# EAGLE design main (EAGLE 6.6.0)
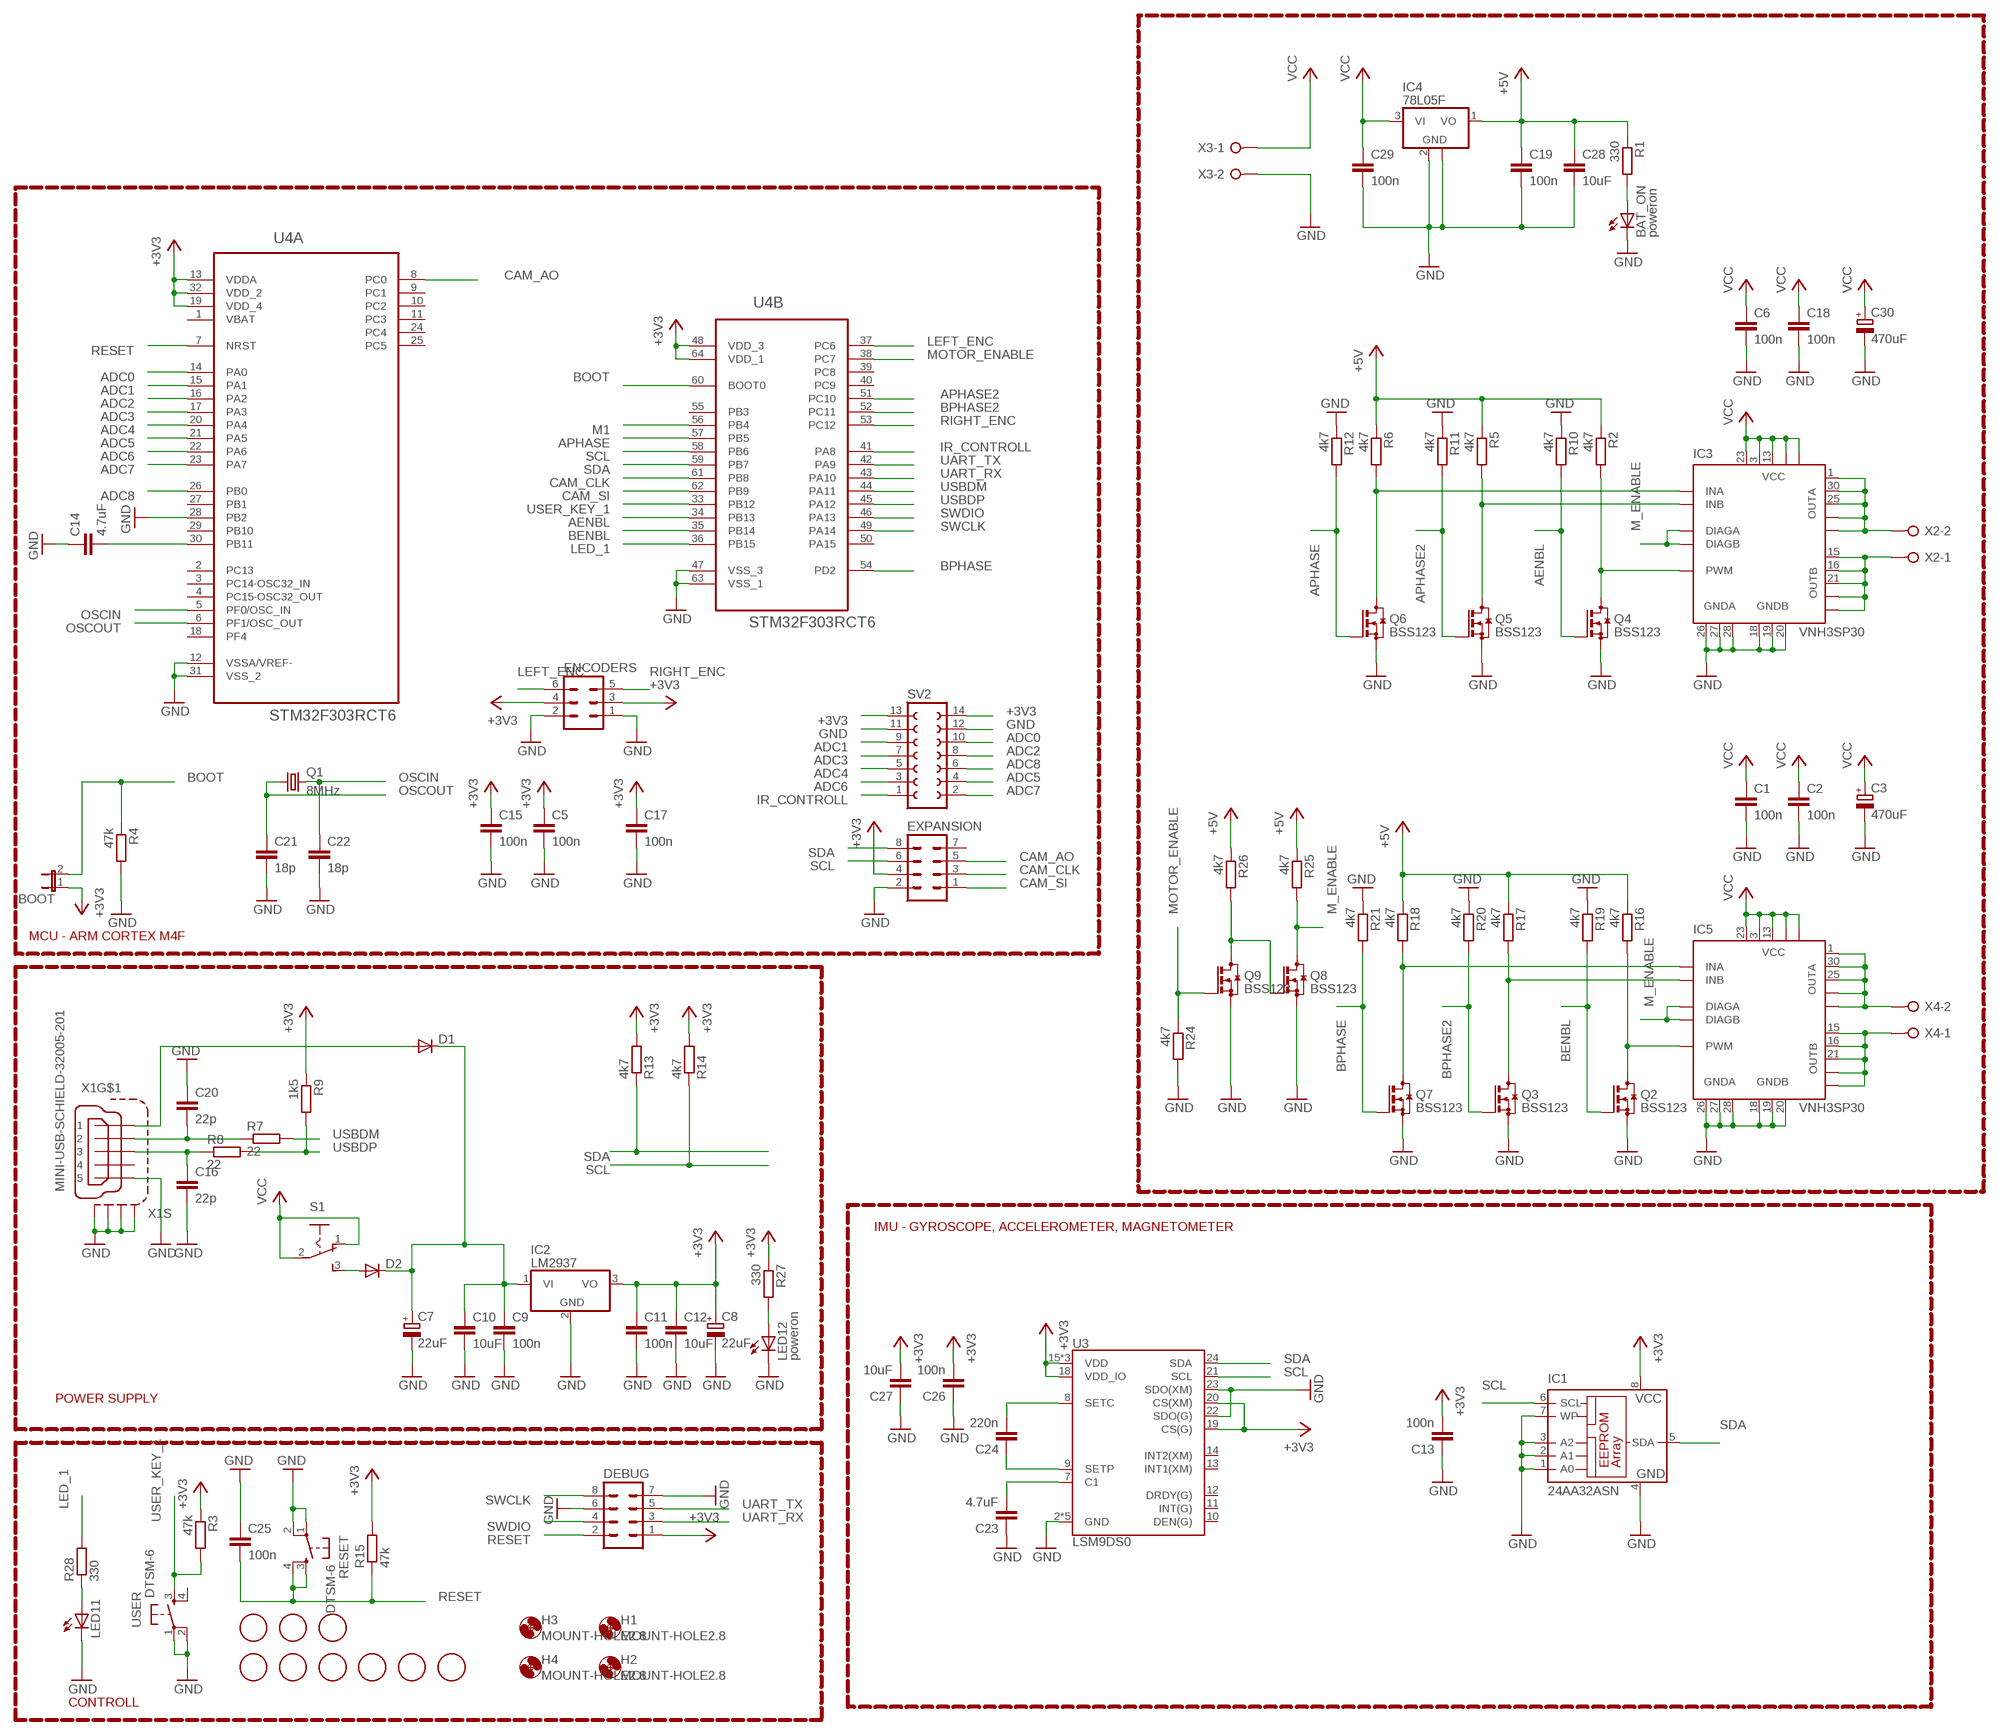
[diagram p0: schematic, sheet 1]

## Parts
BAT_ON  poweron  LEDCHIPLED_1206  [CHIPLED_1206]
BOOT  JP1E  [JP1]
C1  100n  C-EUC0805  [C0805]
C2  100n  C-EUC0805  [C0805]
C3  470uF  CPOL-EU140CLH-1014  [140CLH-1014]
C5  100n  C-EUC0805  [C0805]
C6  100n  C-EUC0805  [C0805]
C7  22uF  CPOL-EU153CLV-0505  [153CLV-0505]
C8  22uF  CPOL-EU153CLV-0505  [153CLV-0505]
C9  100n  C-EUC0805  [C0805]
C10  10uF  C-EUC0805  [C0805]
C11  100n  C-EUC0805  [C0805]
C12  10uF  C-EUC0805  [C0805]
C13  100n  C-EUC0805  [C0805]
C14  4.7uF  C-EUC0805  [C0805]
C15  100n  C-EUC0805  [C0805]
C16  22p  C-EUC0805  [C0805]
C17  100n  C-EUC0805  [C0805]
C18  100n  C-EUC0805  [C0805]
C19  100n  C-EUC0805  [C0805]
C20  22p  C-EUC0805  [C0805]
C21  18p  C-EUC0805  [C0805]
C22  18p  C-EUC0805  [C0805]
C23  4.7uF  C-EUC0805  [C0805]
C24  220n  C-EUC0805  [C0805]
C25  100n  C-EUC0805  [C0805]
C26  100n  C-EUC0805  [C0805]
C27  10uF  C-EUC0805  [C0805]
C28  10uF  C-EUC0805  [C0805]
C29  100n  C-EUC0805  [C0805]
C30  470uF  CPOL-EU140CLH-1014  [140CLH-1014]
D1  DIODE-SMB  [SMB]
D2  DIODE-SMB  [SMB]
DEBUG  MA04-2  [MA04-2]
ENCODERS  MA03-2  [MA03-2]
EXPANSION  MA04-2  [MA04-2]
H1  MOUNT-HOLE2.8  [2,8]
H2  MOUNT-HOLE2.8  [2,8]
H3  MOUNT-HOLE2.8  [2,8]
H4  MOUNT-HOLE2.8  [2,8]
IC1  24AA32ASN  [SO-08]
IC2  LM2937  [TO263-3]
IC3  VNH3SP30  [MULTIPOWERSO-30]
IC4  78L05F  [SOT89]
IC5  VNH3SP30  [MULTIPOWERSO-30]
LED11  LEDCHIPLED_1206  [CHIPLED_1206]
LED12  poweron  LEDCHIPLED_1206  [CHIPLED_1206]
Q1  8MHz  CRYSTALCTS406  [CTS406]
Q2  BSS123  [SOT23]
Q3  BSS123  [SOT23]
Q4  BSS123  [SOT23]
Q5  BSS123  [SOT23]
Q6  BSS123  [SOT23]
Q7  BSS123  [SOT23]
Q8  BSS123  [SOT23]
Q9  BSS123  [SOT23]
R1  330  R-EU_M0805  [M0805]
R2  4k7  R-EU_M0805  [M0805]
R3  47k  R-EU_M0805  [M0805]
R4  47k  R-EU_M0805  [M0805]
R5  4k7  R-EU_M0805  [M0805]
R6  4k7  R-EU_M0805  [M0805]
R7  22  R-EU_M0805  [M0805]
R8  22  R-EU_M0805  [M0805]
R9  1k5  R-EU_M0805  [M0805]
R10  4k7  R-EU_M0805  [M0805]
R11  4k7  R-EU_M0805  [M0805]
R12  4k7  R-EU_M0805  [M0805]
R13  4k7  R-EU_M0805  [M0805]
R14  4k7  R-EU_M0805  [M0805]
R15  47k  R-EU_M0805  [M0805]
R16  4k7  R-EU_M0805  [M0805]
R17  4k7  R-EU_M0805  [M0805]
R18  4k7  R-EU_M0805  [M0805]
R19  4k7  R-EU_M0805  [M0805]
R20  4k7  R-EU_M0805  [M0805]
R21  4k7  R-EU_M0805  [M0805]
R24  4k7  R-EU_M0805  [M0805]
R25  4k7  R-EU_M0805  [M0805]
R26  4k7  R-EU_M0805  [M0805]
R27  330  R-EU_M0805  [M0805]
R28  330  R-EU_M0805  [M0805]
RESET  DTSM-6  [DTSM-6]
S1  255SB  [255SB]
SV2  FE07-2  [FE07-2]
U3  LSM9DS0  [LGA-24]
U4  STM32F303RCT6  [QFP50P1200X1200X160-64N]
U$1  FIDUCIAL  [FIDUCIAL_1MM]
U$2  FIDUCIAL  [FIDUCIAL_1MM]
U$3  FIDUCIAL  [FIDUCIAL_1MM]
U$4  FIDUCIAL  [FIDUCIAL_1MM]
U$5  FIDUCIAL  [FIDUCIAL_1MM]
U$6  FIDUCIAL  [FIDUCIAL_1MM]
U$7  FIDUCIAL  [FIDUCIAL_1MM]
U$8  FIDUCIAL  [FIDUCIAL_1MM]
U$9  FIDUCIAL  [FIDUCIAL_1MM]
USER  DTSM-6  [DTSM-6]
X1  MINI-USB-SCHIELD-32005-201  [32005-201]
X2  W237-02P  [W237-132]
X3  W237-02P  [W237-132]
X4  W237-02P  [W237-132]

## Nets
+3V3: BOOT.1 C5.1 C8.+ C11.1 C12.1 C13.2 C15.1 C17.1 C26.2 C27.2 DEBUG.1 ENCODERS.3 ENCODERS.4 EXPANSION.4 IC1.8(VCC) IC2.3(VO) R3.1 R9.1 R13.2 R14.2 R15.2 R27.1 SV2.13 SV2.14 U3.15(VDD) U3.16(VDD) U3.17(VDD) U3.18(VDD_IO) U3.19(CS(G)) U3.20(CS(XM)) U4.13(A:VDDA) U4.19(A:VDD_4) U4.32(A:VDD_2) U4.48(B:VDD_3) U4.64(B:VDD_1)
+5V: C19.1 C28.1 IC4.1(VO) R1.1 R2.1 R5.1 R6.1 R16.1 R17.1 R18.1 R25.1 R26.1
ADC0: SV2.10 U4.14(A:PA0)
ADC1: SV2.9 U4.15(A:PA1)
ADC2: SV2.8 U4.16(A:PA2)
ADC3: SV2.7 U4.17(A:PA3)
ADC4: SV2.5 U4.20(A:PA4)
ADC5: SV2.4 U4.21(A:PA5)
ADC6: SV2.3 U4.22(A:PA6)
ADC7: SV2.2 U4.23(A:PA7)
ADC8: SV2.6 U4.26(A:PB0)
AENBL: Q4.1(G) R10.2 U4.34(B:PB13)
APHASE: Q6.1(G) R12.2 U4.57(B:PB5)
APHASE2: Q5.1(G) R11.2 U4.51(B:PC10)
BENBL: Q2.1(G) R19.2 U4.35(B:PB14)
BOOT: BOOT.2 R4.1 U4.60(B:BOOT0)
BPHASE: Q7.1(G) R21.2 U4.54(B:PD2)
BPHASE2: Q3.1(G) R20.2 U4.52(B:PC11)
CAM_AO: EXPANSION.5 U4.8(A:PC0)
CAM_CLK: EXPANSION.3 U4.61(B:PB8)
CAM_SI: EXPANSION.1 U4.62(B:PB9)
GND: BAT_ON.C C1.2 C2.2 C3.- C5.2 C6.2 C7.- C8.- C9.2 C10.2 C11.2 C12.2 C13.1 C14.1 C15.2 C16.2 C17.2 C18.2 C19.2 C20.1 C21.2 C22.2 C23.1 C25.1 C26.1 C27.1 C28.2 C29.2 C30.- DEBUG.6 DEBUG.7 ENCODERS.1 ENCODERS.2 EXPANSION.2 IC1.1(A0) IC1.2(A1) IC1.3(A2) IC1.4(GND) IC1.7(WP) IC2.2(GND) IC3.18(GNDB) IC3.19(GNDB) IC3.20(GNDB) IC3.26(GNDA) IC3.27(GNDA) IC3.28(GNDA) IC4.2(GND) IC4.2@1(GND) IC5.18(GNDB) IC5.19(GNDB) IC5.20(GNDB) IC5.26(GNDA) IC5.27(GNDA) IC5.28(GNDA) LED11.C LED12.C Q2.2(S) Q3.2(S) Q4.2(S) Q5.2(S) Q6.2(S) Q7.2(S) Q8.2(S) Q9.2(S) R4.2 R10.1 R11.1 R12.1 R19.1 R20.1 R21.1 R24.2 RESET.1 RESET.2 SV2.11 SV2.12 U3.2(GND) U3.3(GND) U3.4(GND) U3.5(GND) U3.6(GND) U3.22(SDO(G)) U3.23(SDO(XM)) U4.12(A:VSSA/VREF-) U4.28(A:PB2) U4.31(A:VSS_2) U4.47(B:VSS_3) U4.63(B:VSS_1) USER.1 USER.2 X1.5 X1.M1(S:S1) X1.M2(S:S2) X1.M3(S:S3) X1.M4(S:S4) X3.2
IR_CONTROLL: SV2.1 U4.41(B:PA8)
LED_1: R28.2 U4.36(B:PB15)
LEFT_ENC: ENCODERS.6 U4.37(B:PC6)
M1: U4.56(B:PB4)
M_ENABLE: IC3.6(DIAGA) IC3.10(DIAGB) IC5.6(DIAGA) IC5.10(DIAGB) Q8.3(D) R25.2
MOTOR_ENABLE: Q9.1(G) R24.1 U4.38(B:PC7)
N$1: D2.A S1.3(S)
N$2: C7.+ C9.1 C10.1 D1.C D2.C IC2.1(VI)
N$3: BAT_ON.A R1.2
N$4: IC5.5(INA) Q7.3(D) R18.2
N$5: IC5.11(INB) Q3.3(D) R17.2
N$6: C23.2 U3.7(C1)
N$7: C24.2 U3.8(SETC)
N$8: IC5.8(PWM) Q2.3(D) R16.2
N$9: IC5.1(OUTA) IC5.25(OUTA) IC5.30(OUTA) IC5.OUTA IC5.OUTA@1(OUTA) X4.2
N$13: C24.1 U3.9(SETP)
N$14: IC5.15(OUTB) IC5.16(OUTB) IC5.21(OUTB) IC5.OUTB IC5.OUTB@1(OUTB) X4.1
N$15: C14.2 U4.30(A:PB11)
N$17: Q8.1(G) Q9.3(D) R26.2
N$18: IC3.5(INA) Q6.3(D) R6.2
N$19: IC3.11(INB) Q5.3(D) R5.2
N$20: IC3.8(PWM) Q4.3(D) R2.2
N$21: IC3.1(OUTA) IC3.25(OUTA) IC3.30(OUTA) IC3.OUTA IC3.OUTA@1(OUTA) X2.2
N$23: LED12.A R27.2
N$24: IC3.15(OUTB) IC3.16(OUTB) IC3.21(OUTB) IC3.OUTB IC3.OUTB@1(OUTB) X2.1
N$33: LED11.A R28.1
N$55: C20.2 R7.1 X1.2
N$56: C16.1 R8.1 X1.3
N$57: D1.A X1.1
OSCIN: C22.1 Q1.3 U4.5(A:PF0/OSC_IN)
OSCOUT: C21.1 Q1.1 U4.6(A:PF1/OSC_OUT)
RESET: C25.2 DEBUG.2 R15.1 RESET.3 RESET.4 U4.7(A:NRST)
RIGHT_ENC: ENCODERS.5 U4.53(B:PC12)
SCL: EXPANSION.6 IC1.6(SCL) R14.1 U3.21(SCL) U4.58(B:PB6)
SDA: EXPANSION.8 IC1.5(SDA) R13.1 U3.24(SDA) U4.59(B:PB7)
SWCLK: DEBUG.8 U4.49(B:PA14)
SWDIO: DEBUG.4 U4.46(B:PA13)
UART_RX: DEBUG.3 U4.43(B:PA10)
UART_TX: DEBUG.5 U4.42(B:PA9)
USBDM: R7.2 U4.44(B:PA11)
USBDP: R8.2 R9.2 U4.45(B:PA12)
USER_KEY_1: R3.2 U4.33(B:PB12) USER.3
VCC: C1.1 C2.1 C3.+ C6.1 C18.1 C29.1 C30.+ IC3.3(VCC) IC3.13(VCC) IC3.23(VCC) IC3.VCC IC3.VCC@1(VCC) IC4.3(VI) IC5.3(VCC) IC5.13(VCC) IC5.23(VCC) IC5.VCC IC5.VCC@1(VCC) S1.1(O) S1.2(P) X3.1
Unconnected: EXPANSION.7 U3.10(DEN(G)) U3.11(INT(G)) U3.12(DRDY(G)) U3.13(INT1(XM)) U3.14(INT2(XM)) U4.2(A:PC13) U4.3(A:PC14-OSC32_IN) U4.4(A:PC15-OSC32_OUT) U4.9(A:PC1) U4.10(A:PC2) U4.11(A:PC3) U4.18(A:PF4) U4.24(A:PC4) U4.25(A:PC5) U4.27(A:PB1) U4.29(A:PB10) U4.39(B:PC8) U4.40(B:PC9) U4.50(B:PA15) U4.55(B:PB3) USER.4 X1.4

## Notes on the sheet
- MCU - ARM CORTEX M4F
- IMU - GYROSCOPE, ACCELEROMETER, MAGNETOMETER
- POWER SUPPLY
- CONTROLL

## Power pins joined to a net without a drawn wire
VBAT: U4.1(A:VBAT)

## Library data of the parts
BAT_ON LED11 LED12 = led:LED: LED OSRAM: - CHIPLED LG R971, LG N971, LY N971, LG Q971, LY Q971, LO R971, LY R971 LH N974, LH R974 LS Q976, LO Q976, LY Q976 LO Q996 - Hyper CHIPLED LW Q18S LB Q993, LB Q99A, LB R99A - SideLED LS A670, LO A670, LY A670, LG A670, LP A670 LB A673, LV A673, LT A673, LW A673 LH A674 LY A675 LS A676, LA A676, LO A676, LY A676, LW A676 LS A679, LY A679, LG A679 - Hyper Micro SIDELED® LS Y876, LA Y876, LO Y876, LY Y876 LT Y87S - SmartLED LW L88C, LW L88S LB L89C, LB L89S, LG L890 LS L89K, LO L89K, LY L89K LS L896, LA L896, LO L896, LY L896 - TOPLED LS T670, LO T670, LY T670, LG T670, LP T670 LSG T670, LSP T670, LSY T670, LOP T670, LYG T670 LG T671, LOG T671, LSG T671 LB T673, LV T673, LT T673, LW T673 LH T674 LS T676, LA T676, LO T676, LY T676, LB T676, LH T676, LSB T676, LW T676 LB T67C, LV T67C, LT T67C, LS T67K, LO T67K, LY T67K, LW E67C LS E67B, LA E67B, LO E67B, LY E67B, LB E67C, LV E67C, LT E67C LW T67C LS T679, LY T679, LG T679 LS T770, LO T770, LY T770, LG T770, LP T770 LB T773, LV T773, LT T773, LW T773 LH T774 LS E675, LA E675, LY E675, LS T675 LS T776, LA T776, LO T776, LY T776, LB T776 LHGB T686 LT T68C, LB T68C - Hyper Mini TOPLED® LB M676 - Mini TOPLED Santana® LG M470 LS M47K, LO M47K, LY M47K Source: http://www.osram.convergy.de LUXEON: - LUMILED® LXK2-PW12-R00, LXK2-PW12-S00, LXK2-PW14-U00, LXK2-PW14-V00 LXK2-PM12-R00, LXK2-PM12-S00, LXK2-PM14-U00 LXK2-PE12-Q00, LXK2-PE12-R00, LXK2-PE12-S00, LXK2-PE14-T00, LXK2-PE14-U00 LXK2-PB12-K00, LXK2-PB12-L00, LXK2-PB12-M00, LXK2-PB14-N00, LXK2-PB14-P00, LXK2-PB14-Q00 LXK2-PR12-L00, LXK2-PR12-M00, LXK2-PR14-Q00, LXK2-PR14-R00 LXK2-PD12-Q00, LXK2-PD12-R00, LXK2-PD12-S00 LXK2-PH12-R00, LXK2-PH12-S00 LXK2-PL12-P00, LXK2-PL12-Q00, LXK2-PL12-R00 Source: www.luxeon.com KINGBRIGHT: KA-3528ASYC Source: www.kingbright.com
BOOT = jumper:JP1E: JUMPER
C1 C2 C5 C6 C9-C29 = resistor:C-EU: CAPACITOR, European symbol
C3 C7 C8 C30 = resistor:CPOL-EU: POLARIZED CAPACITOR, European symbol
D1 D2 = diode:DIODE-: DIODE
DEBUG EXPANSION = con-lstb:MA04-2: PIN HEADER; OC_FARNELL: unknown; OC_NEWARK: unknown
ENCODERS = con-lstb:MA03-2: PIN HEADER; OC_FARNELL: unknown; OC_NEWARK: unknown
H1-H4 = holes:MOUNT-HOLE: MOUNTING HOLE with drill center marker
IC1 = microchip:24*: Serial EEPROM I2C; MF: MICROCHIP; MPN: 24AA32A-I/SN; OC_FARNELL: 1617659; OC_NEWARK: 83C5815
IC2 = linear:LM2937: LM2937-2.5, LM2937-3.3 400mA and 500mA Voltage Regulators Source: http://cache.national.com/ds/LM/LM2937-2.5.pdf
IC3 IC5 = st-microelectronics:VNH3SP30: FULLY INTEGRATED H-BRIDGE MOTOR DRIVER Source: http://pdf1.alldatasheet.com/datasheet-pdf/view/84563/STMICROELECTRONICS/VNH3SP30.html; MPN: VNH3SP30-E; OC_FARNELL: 1739420; OC_NEWARK: 33R1486
IC4 = linear:78L*: POSITOIV-VOLTAGE REGULATORS Output up to 100 mA Source: Datasheet <http://focus.ti.com/lit/ds/symlink/ua78l05.pdf>
Q1 = crystal:CRYSTAL: CRYSTAL; OC_FARNELL: unknown; OC_NEWARK: unknown
Q2-Q9 = transistor-small-signal:BSS123: N-CHANNEL MOS FET
R1-R21 R24-R28 = resistor:R-EU_: RESISTOR, European symbol
RESET USER = switch-tact:DTSM-6
S1 = switch:255SB: SLIDING SWITCH Distributor Buerklin, 11G810
SV2 = con-lsta:FE07-2: FEMALE HEADER; OC_FARNELL: unknown; OC_NEWARK: unknown
U3 = SparkFun-DigitalIC:LSM9DS0: LSM9DS0 3D Accelerometer, 3D Gyroscope, 3D Magnetomter Features: 3 acceleration channels, 3 angular rate channels, 3 magnetic field channels ±2/±4/±6/±8/±16 g linear acceleration full scale ±2/±4/±8/±12 gauss magnetic full scale ±245/±500/±2000 dps angular rate full scale 16-bit data output SPI / I2C serial interfaces Analog supply voltage 2.4 V to 3.6 V Power-down mode / low-power mode Programmable interrupt generators Embedded self-test Embedded temperature sensor Embedded FIFO Position and motion detection functions Click/double-click recognition
U4 = my_parts:STM32F303RCT6: ARM Cortex-M4 32b MCU+FPU,LQFP-64; MPN: STM32F303RCT6; OC_FARNELL: 2215112; OC_NEWARK: 46W2193; PACKAGE: LQFP-64; SUPPLIER: STMICROELECTRONICS
U$1-U$9 = adafruit:FIDUCIAL: For use by pick and place machines to calibrate the vision/machine, 1mm By microbuilder.eu
X1 = con-cypressindustries:MINI-USB-SCHIELD-: MINI USB-B Conector Source: www.cypressindustries.com; OC_FARNELL: unknown; OC_NEWARK: unknown
X2-X4 = con-wago-508:W237-02P: WAGO SREW CLAMP; OC_FARNELL: unknown; OC_NEWARK: unknown

## Board
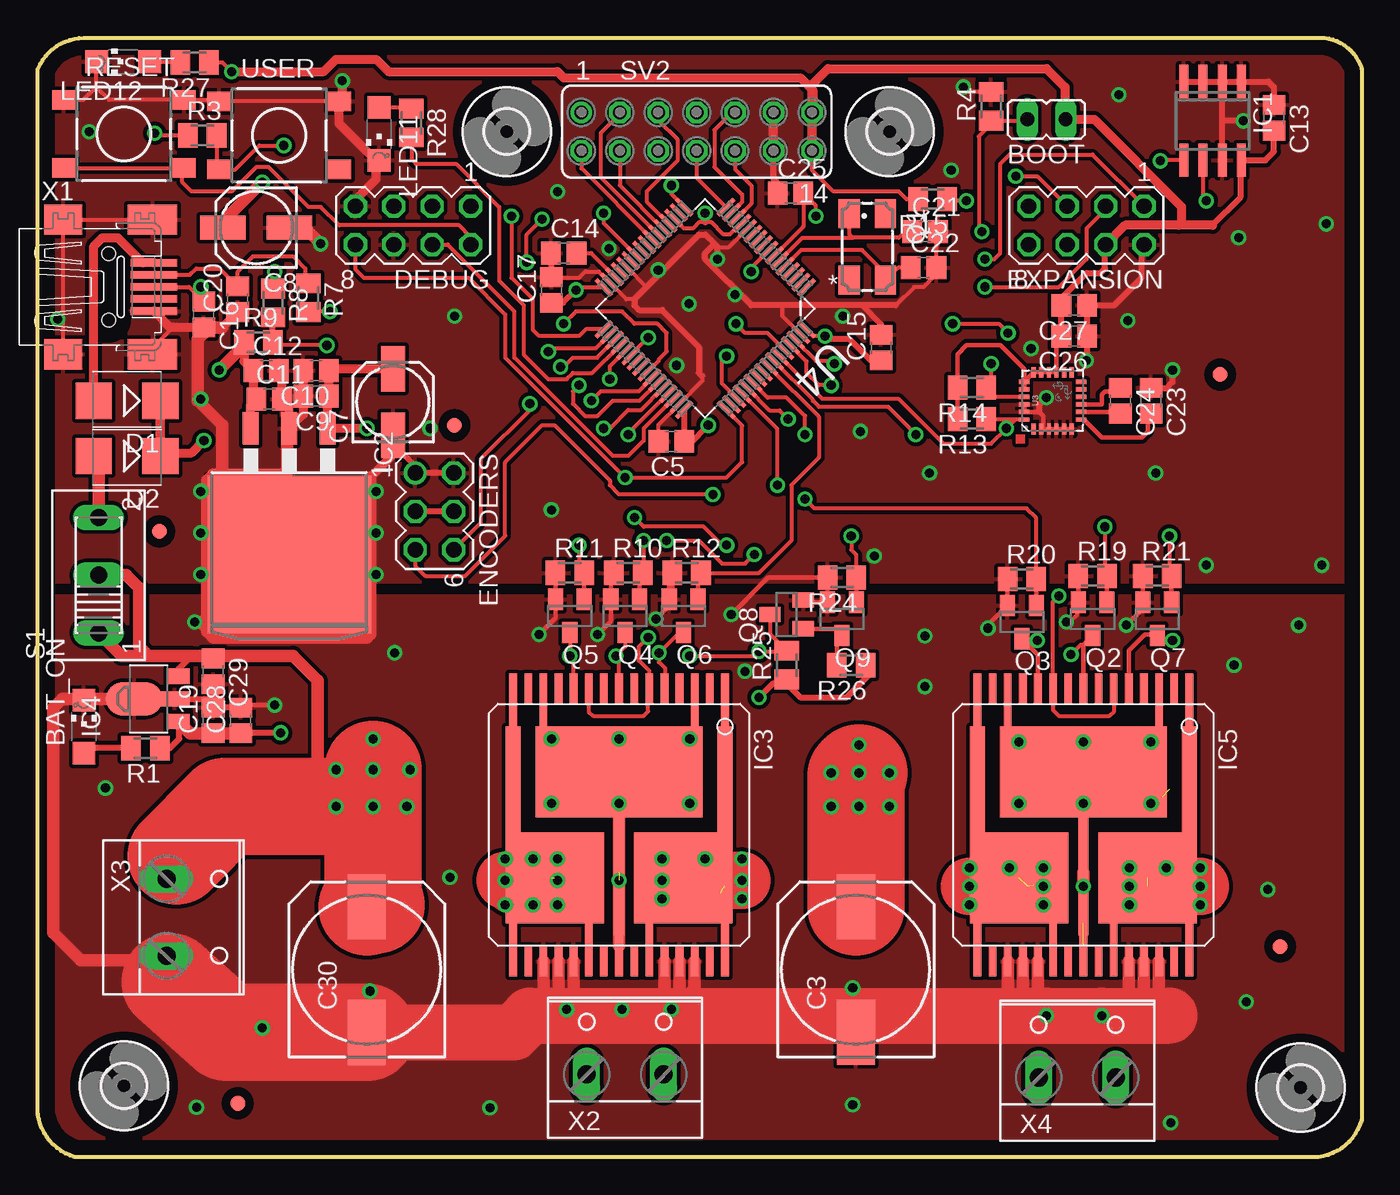
[diagram p1: board, top side]
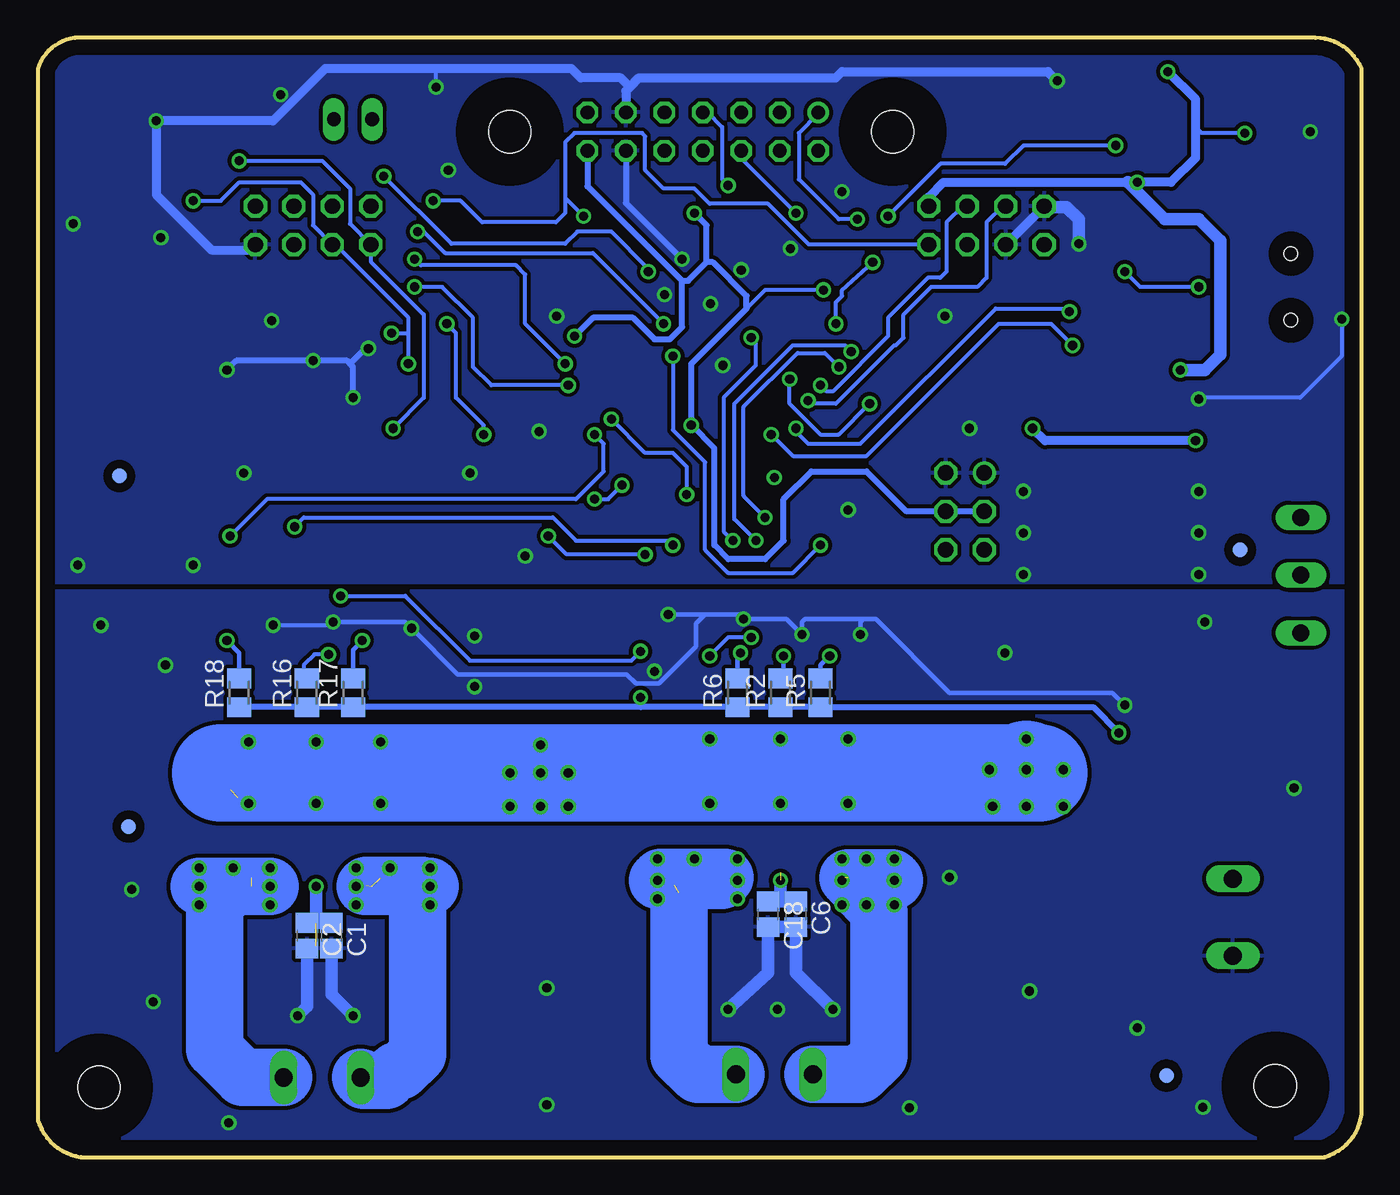
[diagram p2: board, bottom side, seen from below]

Size 87.48 x 73.96 mm. Coordinates in mm from the lower left corner, seen from the top.
Outline: 3.05,73.96 85.04,73.96 arc-66 87.48,71.93 87.48,2.44 arc-66 84.63,0 2.44,0 arc-66 0,2.84 0,71.93 arc-66 3.05,73.96
Copper layers (1*16): Top 0.035mm / dielectric 1.5mm / Bottom 0.035mm
Design rules "default *": minimum track width 10mil, minimum drill 24mil, track to track 10mil, track to pad 10mil, pad to pad 10mil, via to via 10mil, smd to smd 10mil, copper to edge 40mil, drill to drill 8mil, minimum pad ring 10mil, minimum via ring 8mil, stop-mask expansion 4mil, vias tented up to drill 0mil, thermal gap 10mil

### Footprints (pad centres in the part's own frame; a part is rotated, then mirrored left to right if it is on the bottom)
CHIPLED_1206 = smd 1.5 x 1.5: A 0,-1.75; C 0,1.75
JP1 = drill 0.914 long: 1 0,-1.27; 2 0,1.27
C0805 = smd 1.3 x 1.5: 1 -0.85,0; 2 0.85,0
140CLH-1014 = smd 4.3 x 2.5: + 4.15,0; - -4.15,0
153CLV-0505 = smd 3 x 1.6: + 2.2,0; - -2.2,0
SMB = smd 2.4 x 2.4: A 2.2,0; C -2.2,0
MA04-2 = drill 1.016 octagon: 1 -3.81,-1.27; 2 -3.81,1.27; 3 -1.27,-1.27; 4 -1.27,1.27; 5 1.27,-1.27; 6 1.27,1.27; 7 3.81,-1.27; 8 3.81,1.27
MA03-2 = drill 1.016: 1 -2.54,-1.27 | drill 1.016 octagon: 2 -2.54,1.27; 3 0,-1.27; 4 0,1.27; 5 2.54,-1.27; 6 2.54,1.27
2,8 = hole 2.8: 0,0
SO-08 = smd 0.6 x 2.2: 1 -1.905,-2.6; 2 -0.635,-2.6; 3 0.635,-2.6; 4 1.905,-2.6; 5 1.905,2.6; 6 0.635,2.6; 7 -0.635,2.6; 8 -1.905,2.6
TO263-3 = smd 1.067 x 2.159: 1 -2.54,-5.791; 2 0,-5.791; 3 2.54,-5.791 | smd 10.8 x 10.41: TAB 0,2.54
MULTIPOWERSO-30 = smd 0.508 x 12: 1 -7,-4; 15 7,-4; 16 7,4; 30 -7,4 | smd 0.508 x 2: 2 -6,-9; 4 -4,-9; 5 -3,-9; 6 -2,-9; 7 -1,-9; 8 0,-9; 9 1,-9; 10 2,-9; 11 3,-9; 12 4,-9; 14 6,-9; 17 6,9; 18 5,9; 19 4,9; 20 3,9; 22 1,9; 24 -1,9; 26 -3,9; 27 -4,9; 28 -5,9; 29 -6,9 | smd 0.508 x 4: 3 -5,-8; 13 5,-8; 21 2,8; 23 0,8; 25 -2,8 | smd 6.5 x 6: OUTA -4.25,3.5; OUTB 4.25,3.5 | smd 1 x 7.5: OUTA@1 -7,-2.755; OUTB@1 7,-2.755 | smd 11 x 6: VCC 0,-3.5 | smd 0.65 x 8.3: VCC@1 0,3.145
SOT89 = smd 1 x 1.5: 1 -1.499,-1.981; 3 1.499,-1.981 | smd 1 x 2: 2 0,-1.727 | smd 2.2 x 3.7: 2@1 0,0.94
CTS406 = smd 1.9 x 1.4: 1 -2.2,-1.2; 2 2.2,-1.2; 3 2.2,1.2; 4 -2.2,1.2
SOT23 = smd 1 x 1.4: 1 -0.95,-1.1; 2 0.95,-1.1; 3 0,1.1
M0805 = smd 1.3 x 1.6: 1 -0.95,0; 2 0.95,0
DTSM-6 = smd 1.55 x 1.3: 1 -3.975,2.25; 2 3.975,2.25; 3 -3.975,-2.25; 4 3.975,-2.25
255SB = drill 1.118 long: 1 -3.81,0; 2 0,0; 3 3.81,0
FE07-2 = drill 0.914: 1 -7.62,1.27 | drill 0.914 octagon: 2 -7.62,-1.27; 3 -5.08,1.27; 4 -5.08,-1.27; 5 -2.54,1.27; 6 -2.54,-1.27; 7 0,1.27; 8 0,-1.27; 9 2.54,1.27; 10 2.54,-1.27; 11 5.08,1.27; 12 5.08,-1.27; 13 7.62,1.27; 14 7.62,-1.27
LGA-24 = smd 0.7 x 0.29: 1 -1.875,1.25; 2 -1.875,0.75; 3 -1.875,0.25; 4 -1.875,-0.25; 5 -1.875,-0.75; 6 -1.875,-1.25; 13 1.875,-1.25; 14 1.875,-0.75; 15 1.875,-0.25; 16 1.875,0.25; 17 1.875,0.75; 18 1.875,1.25 | smd 0.29 x 0.7: 7 -1.25,-1.875; 8 -0.75,-1.875; 9 -0.25,-1.875; 10 0.25,-1.875; 11 0.75,-1.875; 12 1.25,-1.875; 19 1.25,1.875; 20 0.75,1.875; 21 0.25,1.875; 22 -0.25,1.875; 23 -0.75,1.875; 24 -1.25,1.875
QFP50P1200X1200X160-64N = smd 1.473 x 0.279: 1 -5.715,3.759; 2 -5.715,3.251; 3 -5.715,2.743; 4 -5.715,2.261; 5 -5.715,1.753; 6 -5.715,1.245; 7 -5.715,0.762; 8 -5.715,0.254; 9 -5.715,-0.254; 10 -5.715,-0.762; 11 -5.715,-1.245; 12 -5.715,-1.753; 13 -5.715,-2.261; 14 -5.715,-2.743; 15 -5.715,-3.251; 16 -5.715,-3.759; 33 5.715,-3.759; 34 5.715,-3.251; 35 5.715,-2.743; 36 5.715,-2.261; 37 5.715,-1.753; 38 5.715,-1.245; 39 5.715,-0.762; 40 5.715,-0.254; 41 5.715,0.254; 42 5.715,0.762; 43 5.715,1.245; 44 5.715,1.753; 45 5.715,2.261; 46 5.715,2.743; 47 5.715,3.251; 48 5.715,3.759 | smd 0.279 x 1.473: 17 -3.759,-5.715; 18 -3.251,-5.715; 19 -2.743,-5.715; 20 -2.261,-5.715; 21 -1.753,-5.715; 22 -1.245,-5.715; 23 -0.762,-5.715; 24 -0.254,-5.715; 25 0.254,-5.715; 26 0.762,-5.715; 27 1.245,-5.715; 28 1.753,-5.715; 29 2.261,-5.715; 30 2.743,-5.715; 31 3.251,-5.715; 32 3.759,-5.715; 49 3.759,5.715; 50 3.251,5.715; 51 2.743,5.715; 52 2.261,5.715; 53 1.753,5.715; 54 1.245,5.715; 55 0.762,5.715; 56 0.254,5.715; 57 -0.254,5.715; 58 -0.762,5.715; 59 -1.245,5.715; 60 -1.753,5.715; 61 -2.261,5.715; 62 -2.743,5.715; 63 -3.251,5.715; 64 -3.759,5.715
FIDUCIAL_1MM = smd 1 x 1: 1 0,0
32005-201 = smd 3.1 x 0.5: 1 3,1.6; 2 3,0.8; 3 3,0; 4 3,-0.8; 5 3,-1.6 | smd 2.5 x 2: M1 -3,-4.45; M2 -3,4.45 | smd 3.3 x 2: M3 2.9,4.45; M4 2.9,-4.45 | hole 0.9: 0,2.2; 0,-2.2
W237-132 = drill 1.194 long: 1 -2.54,-0.635; 2 2.54,-0.635

### Placement (x,y rotation side)
BAT_ON  3.05,28.45 0 top
BOOT  66.65,68.58 90 top
C1  68.07,14.63 270 bottom
C2  69.7,14.63 270 bottom
C3  54.05,12.4 90 top
C5  41.86,47.29 180 top
C6  37.39,16.05 270 bottom
C7  23.47,49.89 90 top
C8  14.43,61.42 180 top
C9  18.39,50.29 180 top
C10  18.39,51.97 180 top
C11  15.29,50.09 0 top
C12  15.09,51.97 0 top
C13  81.69,68.68 270 top
C14  34.75,59.74 0 top
C15  55.73,53.49 90 top
C16  10.97,55.68 270 top
C17  33.93,57.3 90 top
C18  39.22,16.05 270 bottom
C19  11.58,28.85 90 top
C20  13.21,56.69 90 top
C21  58.62,61.16 0 top
C22  58.52,58.78 0 top
C23  73.56,49.99 270 top
C24  71.53,49.99 270 top
C25  49.73,63.7 0 top
C26  68.48,54.25 180 top
C27  68.48,56.29 180 top
C28  13.41,28.85 90 top
C29  11.58,32.11 270 top
C30  21.74,12.4 90 top
D1  5.89,49.99 180 top
D2  5.89,46.33 180 top
DEBUG  24.79,61.57 180 top
ENCODERS  26.21,42.67 270 top
EXPANSION  69.29,61.57 180 top
H1  30.99,67.77 0 top
H2  56.29,67.77 0 top
H3  5.7,4.71 0 top
H4  83.44,4.6 0 top
IC1  77.62,68.48 180 top
IC2  16.61,42.37 180 top
IC3  38.4,21.95 180 top
IC4  7.32,30.28 90 top
IC5  69.09,21.95 180 top
LED11  22.56,67.61 180 top
LED12  5.64,72.39 90 top
Q1  54.81,60.15 270 top
Q2  69.7,35.56 180 top
Q3  65.02,35.36 180 top
Q4  38.81,35.76 180 top
Q5  35.15,35.76 180 top
Q6  42.67,35.76 180 top
Q7  73.96,35.56 180 top
Q8  49.48,35.86 90 top
Q9  53.14,35.56 180 top
R1  7.11,27.03 180 top
R2  38.4,30.68 90 bottom
R3  10.87,67.51 0 top
R4  62.99,69.44 90 top
R5  35.76,30.68 90 bottom
R6  41.25,30.68 90 bottom
R7  17.88,56.79 270 top
R8  15.54,56.44 270 top
R9  14.58,53.85 0 top
R10  39.01,38.61 0 top
R11  35.15,38.61 0 top
R12  42.88,38.61 0 top
R13  61.72,48.77 180 top
R14  61.72,50.85 180 top
R15  59.13,63.3 180 top
R16  69.7,30.68 90 bottom
R17  66.65,30.68 90 bottom
R18  74.17,30.68 90 bottom
R19  69.7,38.4 0 top
R20  65.02,38.2 0 top
R21  73.96,38.4 0 top
R24  53.14,38.3 180 top
R25  49.48,32.51 90 top
R26  53.75,32.51 180 top
R27  10.36,72.34 180 top
R28  24.69,68.33 270 top
RESET  5.69,67.61 0 top
S1  4.01,38.46 90 top
SV2  43.54,67.77 0 top
U3  67.06,49.99 90 top
U4  44.09,56.08 225 top
U$1  13.21,3.56 0 top
U$2  82.09,13.92 0 top
U$3  78.13,51.71 0 top
U$4  8.03,41.35 0 top
U$5  82.09,45.01 0 bottom
U$6  81.48,21.84 0 bottom
U$7  8.03,40.13 0 bottom
U$8  12.9,5.38 0 bottom
U$9  27.53,48.36 0 top
USER  15.95,67.51 0 top
X1  4.67,57.51 0 top
X2  38.81,6.1 0 top
X3  9.14,15.85 270 top
X4  68.68,5.89 0 top

### Tracks (layer width: path | path; a pad name or v marks a point on that pad's centre or on a via)
+3V3  (via drill 0.6)
  Top 0.254: R27.1 12.19,72.34 v12.8,71.73 | R3.1 7.87,67.51 v7.72,67.67 | C5.1 U4.48 | U4.13 46.48,61.72 45.72,60.96 45.31,60.96 44.5,61.77 44.09,61.77 43.69,61.77 43.28,61.37 42.69,61.37 U4.19 | R15.2 57.4,63.3 56.9,63.8 52.58,63.8 51.16,65.23 SV2.14 | U4.32 35.72,57.47 v35.56,57.3 | v52.02,54.25 51.24,54.25 U4.64
  Top 0.305: U3.20 U3.19 | U3.19 U3.18 U3.17 U3.16 U3.15 67.31,54.13 C26.2 | U3.19 65.18,52.07 63.6,53.64 61.37,53.64 60.76,53.03 60.76,50.87 R14.2 R13.2
  Top 0.406: C26.2 C27.2 67.67,56.32 67.67,56.79 69.29,58.42 70.21,58.42 70.51,58.72 70.51,60.25 EXPANSION.4 | C13.2 81.69,66.45 81.12,65.88 IC1.8 79.45,65.8 79.45,63.4 77.62,61.57 | 42.67,47.14 42.67,47.26 C5.1 | U4.48 42.71,47.18 42.67,47.14 | 42.67,47.14 43.08,47.14 v44.3,48.36 | v44.09,62.38 44.09,61.77 | C17.1 34.71,56.45 v35.56,57.3 | C15.1 55.05,52.64 53.64,54.05 52.22,54.05 v52.02,54.25 | ENCODERS.4 ENCODERS.3
  Top 0.61: v12.8,71.73 18.9,71.73 19.71,72.54 22.35,72.54 23.16,71.73 34.34,71.73 34.75,71.32 50.39,71.32 51.21,70.51 51.21,69.09 SV2.13 SV2.14 51.16,70.87 52.22,71.93 66.65,71.93 67.87,70.71 67.87,68.63 BOOT.1 69.8,68.58 75.59,62.79 75.59,61.77 75.39,61.57 | 75.39,61.57 71.83,61.57 EXPANSION.4 | 77.62,61.57 75.39,61.57 | R9.1 13.63,52.58 C12.1 14.24,50.29 C11.1 14.07,49.72 IC2.3
  Top 0.813: C8.+ 12.23,61.81 v14.83,64.41 | R9.1 13.63,53.66 v11.99,52.02
  Bottom 0.254: v7.72,67.67 10.57,67.67 10.97,68.07 | v35.56,57.3 39.42,57.3 40.64,56.08
  Bottom 0.406: SV2.14 51.16,64.16 44.91,57.91 | 44.91,57.91 44.5,57.91 43.28,59.13 | 43.28,59.13 42.87,59.13 40.64,56.9 40.64,56.08 44.3,52.43 v44.3,48.36 42.77,46.84 42.77,40.44 41.86,39.52 39.42,39.52 38.2,40.74 38.2,43.48 36.37,45.31 32.71,45.31 30.07,42.67 ENCODERS.3 | 43.28,59.13 43.28,61.57 v44.09,62.38 | 44.91,57.91 44.91,54.86 45.72,54.05 46.74,54.05 48.16,55.47 50.8,55.47 v52.02,54.25
  Bottom 0.61: DEBUG.1 28.6,63.45 27.63,64.41 15.44,64.41 v14.83,64.41 12.6,64.41 10.97,66.04 10.97,68.07 10.97,69.9 v12.8,71.73
  Bottom 0.813: v11.99,52.02 10.36,52.02 9.35,53.03 9.35,60.55 10.77,61.98 13,61.98 15.44,64.41
+5V  (via drill 0.6)
  Top 0.406: v16.05,28.04 13.45,28.04 C28.1 | R1.1 8.74,27.03 9.35,27.63 9.35,28.73 IC4.1 | R25.1 49.48,31.29 | 49.48,31.29 50.39,30.38 53.44,30.38 54.97,31.9 54.97,32.24 R26.1 | 49.48,31.29 48.56,31.29 v47.65,30.38
  Top 0.813: IC4.1 10.07,28 C19.1 C28.1
  Bottom 0.406: 47.65,29.73 R6.1 R2.1 R5.1 17.74,29.73 v16.05,28.04 | 47.65,29.73 R17.1 R16.1 R18.1 | v47.65,30.38 47.65,29.73
ADC0
  Top 0.254: SV2.10 46.08,65.28 47.14,64.21 47.14,63.01 U4.14
ADC1
  Top 0.254: SV2.9 45.87,69.04 44.7,67.87 44.7,65.43 46.53,63.6 46.53,63.12 U4.15
ADC2
  Top 0.254: SV2.8 43.54,64.72 U4.16
ADC3  (via drill 0.6)
  Top 0.254: v41.86,64.21 41.86,63.63 U4.17
  Bottom 0.254: SV2.7 43.23,69.04 42.27,68.07 42.27,64.62 v41.86,64.21
ADC4
  Top 0.254: SV2.5 41,68.53 42.27,67.26 42.27,65.84 40.23,63.8 40.23,63.14 U4.20
ADC5
  Top 0.254: SV2.4 38.46,64.2 U4.21
ADC6
  Top 0.254: SV2.3 38.46,68.94 37.19,67.67 37.19,64.75 U4.22
ADC7
  Top 0.254: SV2.2 35.92,65.34 U4.23
ADC8  (via drill 0.6)
  Top 0.254: v37.39,62.38 37.39,61.71 U4.26
  Bottom 0.254: SV2.6 41,65.99 v37.39,62.38
AENBL  (via drill 0.6)
  Top 0.254: U4.34 36.85,53.44 33.93,53.44 v33.73,53.24 | v40.03,40.74 40.03,38.67 R10.2
  Top 0.305: Q4.1 39.76,38.4 R10.2
  Bottom 0.254: v33.73,53.24 34.14,53.64 37.59,53.64 41.45,49.78 41.45,42.16 v40.03,40.74
APHASE
  Top 0.254: U4.57 51.61,48.92 51.61,46.23 49.78,44.4 49.78,40.74 47.65,38.61 R12.2
  Top 0.305: Q6.1 43.62,38.4 R12.2
APHASE2  (via drill 0.6)
  Top 0.254: U4.51 46.2,50.12 45.21,51.1 45.21,52.93 v45.52,52.93 | v35.76,40.44 35.76,38.95 R11.2
  Top 0.305: Q5.1 R11.2
  Bottom 0.254: v45.52,52.93 45.52,48.06 45.21,47.75 44.91,47.45 43.38,45.92 43.38,40.13 41.86,38.61 37.59,38.61 v35.76,40.44
BENBL  (via drill 0.6)
  Top 0.254: v34.54,52.22 34.75,52.22 35.36,52.83 36.96,52.83 U4.35 | v70.51,41.66 70.51,38.54 R19.2 | v45.52,40.44 45.21,40.44 43.99,41.66 40.03,41.66 v39.42,42.27
  Top 0.305: Q2.1 R19.2
  Bottom 0.254: 34.75,52.43 v34.54,52.22 35.47,53.15 37.28,53.15 40.84,49.58 40.84,43.69 v39.42,42.27 | v70.51,41.66 69.9,42.27 53.44,42.27 51.92,40.74 45.82,40.74 v45.52,40.44
BOOT  (via drill 0.6)
  Top 0.254: BOOT.2 65.29,68.49 R4.1 62.99,68.27 62.18,67.46 62.18,61.37 v62.38,61.16 | U4.60 48.2,54.46 46.74,54.46 v46.13,55.07
  Bottom 0.254: v46.13,55.07 50.8,59.74 60.55,59.74 61.98,61.16 v62.38,61.16
BPHASE  (via drill 0.6)
  Top 0.254: v74.78,41.05 74.78,38.54 R21.2 | v50.7,47.75 50.7,48.97 49.48,50.19 48.23,50.19 U4.54
  Top 0.305: R21.2 Q7.1
  Bottom 0.254: v74.78,41.05 72.34,43.48 51.92,43.48 50.09,45.31 50.09,47.14 v50.7,47.75
BPHASE2  (via drill 0.6)
  Top 0.254: R20.2 65.97,42.23 65.33,42.87 51.31,42.87 v50.7,43.48 | v48.87,44.4 48.87,48.11 U4.52
  Top 0.305: Q3.1 R20.2
  Bottom 0.254: v50.7,43.48 49.78,43.48 v48.87,44.4
CAM_AO  (via drill 0.6)
  Top 0.254: v64.62,64.82 66.04,64.82 EXPANSION.5 | v47.14,58.52 47.14,58.77 U4.8
  Bottom 0.254: v47.14,58.52 47.14,58.72 49.58,61.16 51.82,61.16 52.63,60.35 60.15,60.35 v64.62,64.82
CAM_CLK  (via drill 0.6)
  Top 0.254: EXPANSION.3 70.56,62.64 69.29,61.37 69.29,59.33 67.46,57.51 v62.59,57.51 | v52.43,51 51.61,51 50.8,51.82 50.8,52.57 U4.61
  Bottom 0.254: v52.43,51 57.51,51 58.72,52.22 58.72,55.47 60.76,57.51 v62.59,57.51
CAM_SI  (via drill 0.6)
  Top 0.254: U4.62 50.07,53.96 51.41,52.63 52.43,52.63 v52.63,52.43 | v62.59,59.33 63.19,59.33 63.6,59.74 63.6,65.63 64.21,66.24 69.7,66.24 EXPANSION.1
  Bottom 0.254: v52.63,52.43 55.27,55.07 55.27,58.32 55.88,58.93 62.18,58.93 v62.59,59.33
GND  (via drill 0.6)
  Top 0.254: RESET.1 3.01,69.86 3.86,70.71 | 3.86,70.71 3.86,72.36 LED12.C | 3.86,70.71 4.71,69.86 RESET.2 11.87,69.86 USER.1 USER.2 | C5.2 41.01,48.4 U4.47 43.89,51.28 43.89,51.61 | C14.1 33.9,58.76 34.54,58.11 35.76,58.11 36.17,58.52 37.06,58.52 U4.31 38.89,56.69 39.42,56.69 | C21.2 59.37,61.06 C22.2 59.37,58.36 58.52,57.51 57.91,57.51 56.69,56.29 | R4.2 61.48,70.39 v61.16,70.71 | 44.91,60.15 45.68,60.15 U4.12 | 49.17,56.29 49.17,55.6 U4.63 | U4.28 38.85,58.88 40.23,57.51 | 1.67,55.02 X1.M2 X1.M3 | X1.M4 7.57,53.5 8.94,54.86 | X1.M1 1.67,55.02 | 1.67,55.02 v1.32,55.37 | v67.97,35.36 68.17,35.36 68.68,35.86 68.68,36.59 Q2.2
  Top 0.305: U3.6 U3.5 U3.4 U3.3 U3.2 66.45,48.25 66.45,48.97 66.18,49.24 U3.23 U3.22 | R11.1 Q5.2 34.2,35.63 v33.12,34.54 | R10.1 37.86,38.4 Q4.2 37.86,35.42 v36.98,34.54 | Q6.2 41.72,38.4 R12.1 41.92,36.64 v40.84,35.56 | v15.65,29.87 13.58,29.87 C28.2 | 68.75,36.44 Q2.2 R19.1 | v62.79,34.95 62.79,35.17 Q3.2 R20.1 64.07,36.44 62.99,35.36 | v71.93,35.15 73.01,36.24 Q7.2 R21.1 | Q8.2 50.73,36.66 Q9.2 R24.2 48.26,38.3 v45.82,35.86
  Top 0.406: v69.29,52.63 69.33,52.67 C26.1 C27.1 71.12,56.29 72.95,58.11 72.95,60.15 EXPANSION.2 | v74.98,52.02 74.98,51.21 74.57,50.8 73.6,50.8 C23.1 | 66.18,49.24 66.18,49.72 v66.65,50.19 | IC1.4 IC1.3 IC1.2 | IC1.2 IC1.1 81.32,71.08 81.69,70.71 C13.1 | IC1.7 78.26,68.48 | 78.26,68.48 IC1.2 | v79.65,68.48 78.26,68.48 | 56.69,56.29 54.46,56.29 | 54.46,56.29 49.17,56.29 47.14,56.29 44.09,59.33 44.09,59.74 44.7,60.35 | 44.7,60.35 44.09,60.96 43.69,60.96 40.23,57.51 39.42,56.69 39.42,56.29 39.73,55.98 41.25,55.98 43.69,53.54 43.69,51.82 43.89,51.61 | 44.7,60.35 44.91,60.15 v44.91,59.33 | C25.1 48.88,64.35 48.62,64.62 SV2.12 | 40.84,47.13 C5.2 | C17.2 33.93,59.7 C14.1 | C15.2 55.73,55.02 54.46,56.29 | BAT_ON.C 6.3,30.2 IC4.2@1 | IC4.2 11.01,30.28 C19.2 C28.2 | C29.2 11.58,30.89 | ENCODERS.2 ENCODERS.1 24.94,45.67 23.47,47.14
  Top 0.61: DEBUG.7 20.98,63.25 22.35,64.62 22.35,65.66 LED11.C 22.32,65.86 19.91,68.27 19.91,69.75 USER.2 20.12,69.95 v20.12,71.12 | SV2.12 SV2.11 | C20.1 12.19,54.83 C16.2 10.94,54.86 8.94,54.86 8.71,54.86 X1.5 | C12.2 16.14,51.76 C11.2 16.61,49.62 IC2.2 17.54,49.09 C9.2 C10.2 | C7.- 23.47,47.14 23.47,46.43 21.95,44.91
  Top 0.813: IC3.18 33.4,9.67 33.73,9.35 | IC3.19 34.4,9.49 34.54,9.35 | IC3.20 35.4,10.21 v34.95,9.75 34.75,9.75 34.34,9.35 | IC3.26 41.4,10 v41.86,9.75 | IC3.27 42.4,10.1 v41.86,9.75 | IC3.28 43.4,11.1 v41.86,9.75 | IC5.18 64.09,9.47 64.21,9.35 | IC5.19 65.09,9.49 65.23,9.35 | IC5.20 66.09,9.39 66.04,9.35 | IC5.26 72.09,9.5 71.93,9.35 | IC5.27 73.09,9.41 73.15,9.35 | IC5.28 74.09,9.43 74.17,9.35 | v66.65,9.35 65.43,9.35 | C19.2 11.58,30.89 11.58,31.29 | X3.2 8.2,13 2.84,13 1.02,14.83 1.02,29.67 1.63,30.28 IC4.2@1 IC4.2 | 21.95,44.91 21.95,34.54 21.74,34.34 11.58,34.34 11.18,34.75 11.18,34.95 | 11.18,34.95 11.18,44.7 11.58,45.11 12.19,45.11 | 12.19,45.11 16.26,45.11 16.46,45.31 16.46,48.01 IC2.2 | C8.- 17.63,61.42 v18.69,60.35 | 12.19,54.83 11.34,54.83 10.57,54.05 10.57,49.99 12.19,48.36 12.19,45.11 | v10.36,35.36 10.77,35.36 11.18,34.95
  Top 1.676: X3.2 8.51,11.81 8.74,11.58 | v38.61,9.75 v41.86,9.75 | C3.- 54.05,7.92 53.85,7.72 53.85,9.14 54.05,9.35
  Top 3.683: C30.- 31.41,8.24 32.51,9.35 33.73,9.35 34.34,9.35 34.54,9.35 54.05,9.35 64.21,9.35 65.23,9.35 65.43,9.35 66.04,9.35 v66.65,9.35 v70.31,9.35 71.93,9.35 73.15,9.35 74.17,9.35 74.78,9.35
  Top 6.452: C30.- 12.48,8.24 8.74,11.58
  Bottom 0.254: v61.16,70.71 61.16,71.93 | v1.32,55.37 1.32,52.93 4.06,50.19 10.67,50.19 v10.77,50.09 | v71.93,35.15 68.17,35.15 v67.97,35.36
  Bottom 0.305: 32.92,35.56 36.78,35.56 36.98,35.36 v36.98,34.54 38,35.56 v40.84,35.56 | v33.12,34.54 33.12,35.36 32.92,35.56 | 32.92,35.56 32.11,35.56 27.23,30.68 16.46,30.68 v15.65,29.87 | v67.97,35.36 63.19,35.36 v62.79,34.95 59.74,31.9 48.56,31.9 47.95,31.29 46.43,31.29 43.99,33.73 43.99,35.25 43.38,35.86 | v40.84,35.56 40.94,35.56 | v45.82,35.86 43.38,35.86 | 43.38,35.86 41.15,35.86 v40.84,35.56
  Bottom 0.406: v66.65,50.19 66.65,52.22 66.85,52.43 | 66.85,52.43 67.06,52.63 v69.29,52.63 74.37,52.63 v74.98,52.02 74.98,51.82 | v65.63,53.44 65.84,53.44 66.85,52.43 | SV2.12 48.62,63.04 v44.91,59.33
  Bottom 0.61: DEBUG.7 DEBUG.6 23.52,60.25 | 48.36,70.71 48.62,70.46 SV2.11 | 48.36,70.71 47.75,71.32 34.75,71.32 34.34,71.73 20.73,71.73 v20.12,71.12 | 48.36,70.71 48.97,71.32 51.61,71.32 52.22,71.93 61.16,71.93 68.48,71.93 71.93,68.48 v79.65,68.48 79.65,63.6 76,59.94 73.46,59.94 EXPANSION.2
  Bottom 0.813: v34.95,9.75 37.39,12.19 C6.2 C18.2 39.22,12.19 v41.86,9.75 | C1.2 68.07,10.77 v66.65,9.35 | C2.2 69.7,9.96 v70.31,9.35 | v18.69,60.35 18.69,61.98 19.51,62.79 20.93,62.79 DEBUG.7
  other vias: 3.4,67.77 43.03,56.39 53.19,55.58 42.21,52.32 46.08,57 60.35,65.23 34.34,63.8 41,58.62 37.74,60.05 14.83,8.53 29.87,3.25 27.23,18.49 53.85,3.45 79.86,10.27 79.04,32.51 58.62,31.09 46.74,32.11 23.57,33.32 4.47,24.38 10.49,3.28 81.28,17.68 53.85,11.18 21.95,10.97 74.86,2.27 25.91,48.16 22.35,38.51 22.35,43.99 22.35,41.25 10.77,43.99 10.77,41.25 10.77,38.51 33.93,42.77 27.53,55.58 55.27,39.73 84.84,39.12 83.31,35.15 77.22,39.12 73.86,45.21 58.93,45.21 85.14,61.67 72.03,55.27 79.35,60.76 71.42,70.21 54.36,47.96 58.62,34.44
  pour Bottom: -3.86,79.76 88.8,79.76 88.8,38 -3.86,38
  pour Top: -21.84,82.8 89.71,82.8 89.71,38 -21.84,38
  pour Top: -1.73,37.08 90.93,37.08 90.93,-5.89 -1.73,-5.89
  pour Bottom: -2.34,37.39 90.93,37.39 90.93,-20.52 -2.34,-20.52
IR_CONTROLL  (via drill 0.6)
  Top 0.254: U4.41 40.28,51.86 41.05,52.63 41.05,52.73 41.55,53.24 41.55,54.46 40.94,55.07 39.42,55.07 38.61,55.88 35.56,55.88 v34.75,55.07 | v32.31,59.13 32.31,60.96 v33.32,61.98
  Bottom 0.254: SV2.1 35.92,68.94 37.19,67.67 37.19,64.62 34.54,61.98 v33.32,61.98 | v34.75,55.07 34.75,56.49 34.34,56.9 34.34,57.3 v32.31,59.13
LED_1
  Top 0.254: R28.2 24.69,65.94 24.99,65.63 27.63,65.63 30.48,62.79 30.48,57.91 32.11,56.29 32.11,53.03 33.73,51.41 34.95,51.41 35.36,51.82 36.63,51.82 U4.36
LEFT_ENC  (via drill 0.6)
  Top 0.254: v37.79,51.41 37.79,52.26 U4.37 | v32.51,49.78 32.51,49.38 29.26,46.13 29.26,41.91 ENCODERS.6
  Bottom 0.254: v37.79,51.41 37.79,49.78 35.76,47.75 34.54,47.75 v32.51,49.78
M_ENABLE  (via drill 0.6)
  Top 0.254: Q8.3 48.38,34.56 R25.2 49.44,33.43 v47.65,33.43 47.35,33.12 v43.08,33.12 | IC5.6 71.12,30.91 71.12,29.46 70.81,29.16 67.46,29.16 67.09,29.53 IC5.10 67.09,36.71 v67.46,37.08 | IC3.10 36.4,29.43 36.68,29.16 40.03,29.16 40.33,29.46 40.33,30.88 IC3.6 40.4,32.14 39.73,32.82 39.73,33.73 v40.33,34.34
  Bottom 0.254: v67.46,37.08 63.19,37.08 58.93,32.82 48.26,32.82 v47.65,33.43 | v40.33,34.34 41.86,34.34 v43.08,33.12
MOTOR_ENABLE  (via drill 0.6)
  Top 0.254: R24.1 54.09,39.79 53.75,40.13 v53.75,41.05 | U4.38 39.17,52.99 v40.33,54.15 | v41.55,40.74 43.69,40.74 45.21,39.22 46.74,39.22 v47.35,39.83
  Top 0.305: Q9.1 R24.1
  Bottom 0.254: v41.55,40.74 42.16,41.35 42.16,50.19 40.03,52.32 40.03,53.85 v40.33,54.15 | v47.35,39.83 52.53,39.83 v53.75,41.05
N$1
  Top 0.813: S1.3 4.01,46.01 D2.A
N$2  (via drill 0.6)
  Top 0.61: D2.C D1.C 8.09,46.77 8.33,46.53 10.16,46.53 v10.97,47.35 | C7.+ 19.36,52.09 C10.1 C9.1 19.15,50.2 IC2.1 v21.74,48.16
  Bottom 0.61: v10.97,47.35 20.93,47.35 v21.74,48.16
N$3
  Top 0.406: R1.2 3.38,27.03 BAT_ON.A
N$4  (via drill 0.6)
  Top 0.305: IC5.5 72.09,33.48 73.15,34.54 73.88,34.54 Q7.3 74.29,34.14 v74.98,34.14
  Bottom 0.305: R18.2 74.17,33.32 v74.98,34.14
N$5  (via drill 0.6)
  Top 0.305: IC5.11 66.09,33.19 Q3.3 65.14,34.14 v66.04,34.14
  Bottom 0.305: R17.2 66.65,33.53 v66.04,34.14
N$6
  Top 0.305: U3.7 69.12,48.74 70.31,47.55 72.95,47.55 73.35,47.95 73.35,48.93 C23.2
N$7
  Top 0.305: U3.8 71.43,49.24 C24.2
N$8  (via drill 0.6)
  Top 0.254: 69.09,33.85 68.9,33.85 v68.27,33.22
  Top 0.305: 69.37,34.14 Q2.3 69.09,33.85 IC5.8
  Bottom 0.254: v68.27,33.22 69.19,33.22 69.9,32.51 69.9,31.84 R16.2
N$9  (via drill 0.6)  (1 unrouted)
  Top 0.254: IC5.25 71.09,15.61 v72.14,16.66 v72.14,17.88 | v72.14,17.88 v72.14,19.1 | v72.14,17.88 73.35,17.88 v74.57,19.1 | v76.81,19.1 v76.81,17.88 v76.81,16.66
  Top 0.305: IC5.1 IC5.OUTA@1 76.09,20.61 v74.57,19.1
  Top 3.81: v76.81,17.88 76.15,17.88 IC5.30
  Bottom 3.81: 74.57,17.88 75.79,16.66 75.79,7.11 73.94,5.26 X4.2 | 74.57,17.88 v72.14,17.88 | 74.57,17.88 v76.81,17.88
N$13
  Top 0.305: U3.9 70.26,49.74 70.31,49.78 70.31,50.39 70.51,50.6 71.29,50.6 C24.1
N$14  (via drill 0.6)  (2 unrouted)
  Top 0.254: IC5.15 IC5.OUTB@1 61.98,24.59 61.98,19.41 61.67,19.1 v61.57,19.1 v61.57,17.88 v61.57,16.66 | v66.45,17.88 65.43,17.88 v64.21,19.1 | v66.45,19.1 v66.45,17.88 | v66.45,17.88 v66.45,16.66 67.09,16.02 IC5.21
  Top 3.81: v61.57,17.88 62.02,17.88 IC5.16
  Bottom 0.254: v66.45,16.66 66.45,17.78 66.55,17.88 66.24,17.88
  Bottom 3.81: v61.57,17.88 65.84,17.88 65.77,17.95 IC5.16 62.38,17.65 62.38,6.81 63.5,5.69 63.8,5.69 64.41,5.08 65.96,5.08 X4.1
N$15
  Top 0.254: C14.2 36.56,59.74 U4.30
N$17
  Top 0.305: R26.2 52.8,34.12 Q9.3 52.68,34.91 Q8.1
N$18  (via drill 0.6)
  Top 0.254: IC3.5 41.45,30.99 41.45,32.31 41.05,32.71 v41.05,33.32 42.38,34.66 Q6.3
  Bottom 0.305: R6.2 41.25,33.12 v41.05,33.32
N$19  (via drill 0.6)
  Top 0.254: IC3.11 35.4,32.87 v35.15,33.12 Q5.3
  Bottom 0.305: R5.2 35.76,32.51 v35.15,33.12
N$20  (via drill 0.6)
  Top 0.254: IC3.8 38.4,32.92 v38.2,33.12 38.81,33.73 Q4.3
  Bottom 0.305: v38.2,33.12 38.2,31.84 R2.2
N$21  (via drill 0.6)  (1 unrouted)
  Top 0.406: IC3.1 IC3.OUTA@1 45.4,21.02 v44.09,19.71 45.11,19.71 v46.53,18.29 | v46.53,19.71 v46.53,18.29 | v46.53,18.29 v46.53,17.07 | IC3.25 40.4,16.22 v41.25,17.07
  Top 3.81: v46.53,18.29 42.81,18.29 IC3.OUTA
  Bottom 0.406: v41.25,18.29 42.67,18.29 v44.09,19.71 | v41.25,19.71 v41.25,18.29 | v41.25,17.07 v41.25,18.29 | 41.05,18.29 v41.25,18.29
  Bottom 3.81: X2.2 43.87,5.46 45.11,6.71 45.11,17.47 44.3,18.29 42.27,18.29 42.06,18.49 46.33,18.49 v46.53,18.29
N$23
  Top 0.254: LED12.A 9.36,72.39 R27.2
N$24  (via drill 0.6)  (1 unrouted)
  Top 0.406: IC3.15 IC3.OUTB@1 31.4,20.23 | 31.4,20.23 v30.89,19.71 v30.89,18.29 | 31.4,20.23 31.92,19.71 v32.71,19.71 v34.34,19.71 v34.34,18.29 v34.34,16.66 | v34.34,16.66 v32.71,16.66 | IC3.21 36.4,17.04 36.17,17.27 34.95,17.27 v34.34,16.66
  Top 3.81: v30.89,18.29 31.06,18.29 IC3.16
  Bottom 0.406: 31.9,16.19 31.36,16.19 v30.89,16.66
  Bottom 3.81: X2.1 33.15,5.46 31.9,6.71 31.9,16.19 33.95,18.45 31.04,18.45 v30.89,18.29
N$33
  Top 0.254: LED11.A 24.6,69.36 R28.1
N$55
  Top 0.254: R7.1 17.68,57.95 17.68,58.72 16.87,59.54 14.22,59.54 13.21,58.52 C20.2 12.03,58.72 10.46,58.72 10.05,58.31 X1.2
N$56  (via drill 0.6)
  Top 0.254: v10.77,57.51 10.97,57.3 C16.1 9.99,57.51 X1.3 | v15.65,58.52 15.65,57.49 R8.1
  Bottom 0.254: v10.77,57.51 14.63,57.51 v15.65,58.52
N$57
  Top 0.61: D1.A 3.69,60.18 4.27,60.76 5.28,60.76 6.93,59.11 X1.1
OSCIN
  Top 0.254: U4.5 50.43,59.94 54.46,59.94 56.01,58.39 Q1.3 56.84,58.78 C22.1
OSCOUT
  Top 0.254: 53.41,62.35 Q1.1 53.64,62.32 53.64,60.96 53.85,60.76 | U4.6 50.53,60.76 53.85,60.76 | C21.1 57.3,61.16 56.9,60.76 53.85,60.76
RESET  (via drill 0.6)
  Top 0.254: RESET.3 RESET.4 9.55,65.25 9.55,64.41 10.16,63.8 12.8,63.8 14.43,65.43 15.24,65.43 17.88,62.79 18.69,62.79 19.91,61.57 27.84,61.57 28.6,60.81 DEBUG.2 | U4.7 50.58,61.49 C25.2 51.41,62.88 v51.41,62.18 | v61.37,63.19 60.18,63.19 R15.1
  Bottom 0.254: DEBUG.2 36.52,60.3 39.22,62.99 43.08,62.99 44.09,64.01 46.13,64.01 47.35,65.23 47.35,67.46 47.55,67.67 52.02,67.67 52.63,67.06 52.63,63.4 | 52.63,63.4 v51.41,62.18 | 52.63,63.4 52.63,62.38 53.24,61.77 58.11,61.77 59.54,63.19 v61.37,63.19
RIGHT_ENC  (via drill 0.6)
  Top 0.254: U4.53 48.36,49.34 49.01,49.34 v49.58,48.77 | ENCODERS.5 24.94,39.06 25.6,38.4 28.24,38.4 30.89,41.05 30.89,45.92 33.32,48.36 34.14,48.36 37.79,44.7 37.79,44.4 38.4,43.79 v44.6,43.79
  Bottom 0.254: v44.6,43.79 44.6,45.62 45.52,46.53 47.35,46.53 v49.58,48.77
SCL  (via drill 0.6)
  Top 0.254: IC1.6 76.99,63.42 v77.22,63.19 | U4.58 51.21,50.05 51.21,49.99 51.61,49.58 56.18,49.58 v58.01,47.75 | v62.99,52.43 62.99,51.17 R14.1 63.29,50.24 U3.21 | v60.45,55.07 63.5,55.07 v64.11,54.46
  Bottom 0.254: v77.22,63.19 75.39,63.19 74.17,64.41 70.1,64.41 69.29,63.6 69.29,61.57 EXPANSION.6 68.02,60.1 67.61,60.1 62.99,55.47 62.99,54.46 | v62.99,52.43 62.99,54.46 | v58.01,47.75 58.01,48.36 59.84,50.19 59.84,54.46 v60.45,55.07 | v64.11,54.46 62.99,54.46
SDA  (via drill 0.6)
  Top 0.254: IC1.5 74.21,65.88 v74.17,65.84 | R13.1 62.7,48.74 U3.24 64.59,48.74 64.46,48.62 v64.01,48.16 62.99,47.14 59.84,47.14 56.86,50.12 51.82,50.12 U4.59
  Bottom 0.254: v74.17,65.84 68.68,65.84 66.85,64.01 66.85,61.67 EXPANSION.8 65.48,59.18 61.98,55.68 61.98,50.19 v64.01,48.16
SWCLK  (via drill 0.6)
  Top 0.254: DEBUG.8 20.98,58.67 21.54,58.11 28.45,58.11 30.89,55.68 30.89,52.83 v38.81,44.91 45.52,44.91 46.53,45.92 46.53,48.33 U4.49
SWDIO
  Top 0.254: DEBUG.4 27.08,60.3 31.5,55.88 31.5,52.83 38,46.33 39.01,46.33 40.03,47.35 40.03,48.16 41.97,50.1 U4.46
UART_RX  (via drill 0.6)
  Top 0.254: v35.76,51 35.36,50.6 35.36,49.78 36.17,48.97 36.98,48.97 38,49.99 39.76,49.99 U4.43
  Bottom 0.254: DEBUG.3 26.36,62.84 27.43,61.77 27.43,58.52 27.84,58.11 28.65,58.11 31.29,55.47 31.29,54.25 34.95,50.6 35.36,50.6 v35.76,51
UART_TX  (via drill 0.6)
  Top 0.254: U4.42 39.69,50.6 37.19,50.6 v36.58,49.99
  Bottom 0.254: DEBUG.5 23.72,62.84 24.79,61.77 24.79,58.11 25.4,57.51 28.45,57.51 30.28,55.68 30.28,54.15 30.78,53.64 30.89,53.64 34.75,49.78 36.37,49.78 v36.58,49.99
USBDM  (via drill 0.6)
  Top 0.254: v37.39,48.16 37.79,48.16 39.01,49.38 39.87,49.38 U4.44 | v19.3,55.88 17.92,55.88 R7.2
  Bottom 0.254: v37.39,48.16 37.39,47.95 36.58,47.14 33.12,47.14 24.18,56.08 19.51,56.08 v19.3,55.88
USBDP  (via drill 0.6)
  Top 0.254: v39.01,47.75 39.01,47.81 U4.45 | v19.1,53.64 15.73,53.64 R9.2
  Top 0.406: R9.2 15.53,55.47 R8.2
  Bottom 0.254: v39.01,47.75 37.59,46.33 32.71,46.33 23.98,55.07 20.52,55.07 v19.1,53.64
USER_KEY_1  (via drill 0.6)
  Top 0.254: R3.2 11.82,65.42 USER.3 13.04,65.26 14.63,66.85 v16.26,66.85 | v31.29,62.18 31.29,58.11 32.71,56.69 32.71,54.66 33.12,54.25 35.76,54.25 36.21,54.7 U4.33
  Bottom 0.254: v16.26,66.85 22.35,66.85 23.57,65.63 27.84,65.63 v31.29,62.18
VCC  (via drill 0.6)  (3 unrouted)
  Top 0.254: v19.71,23.16 v19.71,25.6 | 22.35,23.06 22.15,23.27 v22.15,25.6 v22.15,27.63 | v24.59,25.6 24.38,25.4 v24.38,23.16 v22.15,23.16 | v52.43,23.16 v54.25,23.16 | v54.25,23.16 v56.29,23.16 | v56.29,25.4 v54.25,25.4 | v54.25,25.4 v54.25,23.16 | v52.43,25.4 v54.25,25.4 | v54.25,25.4 v54.25,27.23 | v64.82,27.43 v69.09,27.43 | v64.82,23.37 v64.82,27.43 | v69.09,27.43 IC5.VCC v69.09,23.37 v69.09,17.88 | v64.82,27.43 64.31,27.43 64.11,27.63 64.11,29.97 | 64.11,30.68 64.11,29.97 | 64.11,29.97 IC5.13 | 73.96,27.43 v73.56,27.43 v69.09,27.43 | 73.96,27.43 74.17,27.63 74.17,29.87 IC5.3 | 73.96,27.43 73.96,23.77 | 73.96,23.77 v73.56,23.37 | 73.96,23.77 74.27,23.77
  Top 0.406: IC4.3 9.3,32.26 10.16,33.12 11.42,33.12 C29.1 | IC3.VCC v38.4,27.63 | IC3.3 43.4,27.96 v43.08,27.63 | IC3.13 33.4,28.16 v33.93,27.63
  Top 0.813: IC3.23 v38.4,18.29 v38.4,23.37 IC3.VCC | v69.09,17.88 IC5.VCC@1 | 18.29,23.16 18.49,23.37 18.49,31.5 16.87,33.12 10.16,33.12 7.31,33.12 | 7.31,33.12 5.54,33.12 S1.1 | S1.2 5.84,38.46 6.71,37.59 6.71,33.73 7.31,33.12
  Top 1.676: X3.1 8.51,19.28 9.14,19.91
  Top 6.452: C3.+ 54.05,25.2 v54.25,25.4 | v22.15,25.6 v22.15,23.16 | v22.15,23.16 22.15,16.87 22.35,16.66 21.86,16.66 C30.+ | v22.15,23.16 v19.71,23.16 18.29,23.16 12.39,23.16 9.14,19.91
  Bottom 0.254: 74.78,24.28 74.78,25.4 | v38.4,18.29 38.51,18.19
  Bottom 0.813: C6.1 C18.1 38.57,16.9 38.4,17.07 v38.4,18.29 | C1.1 C2.1 69.12,15.48 69.09,15.44 v69.09,17.88 | 35.76,25.4 35.56,25.6 v33.93,27.63 v33.93,23.37 | 36.37,25.4 36.58,25.6 v38.4,27.63 42.87,25.6 v43.08,27.63 v43.08,23.37
  Bottom 6.452: 75.39,25.4 74.78,25.4 v54.25,25.4 36.37,25.4 35.76,25.4 21.34,25.4 v22.15,25.6
(copper drawn outside any net)
  shapes: Top area x1